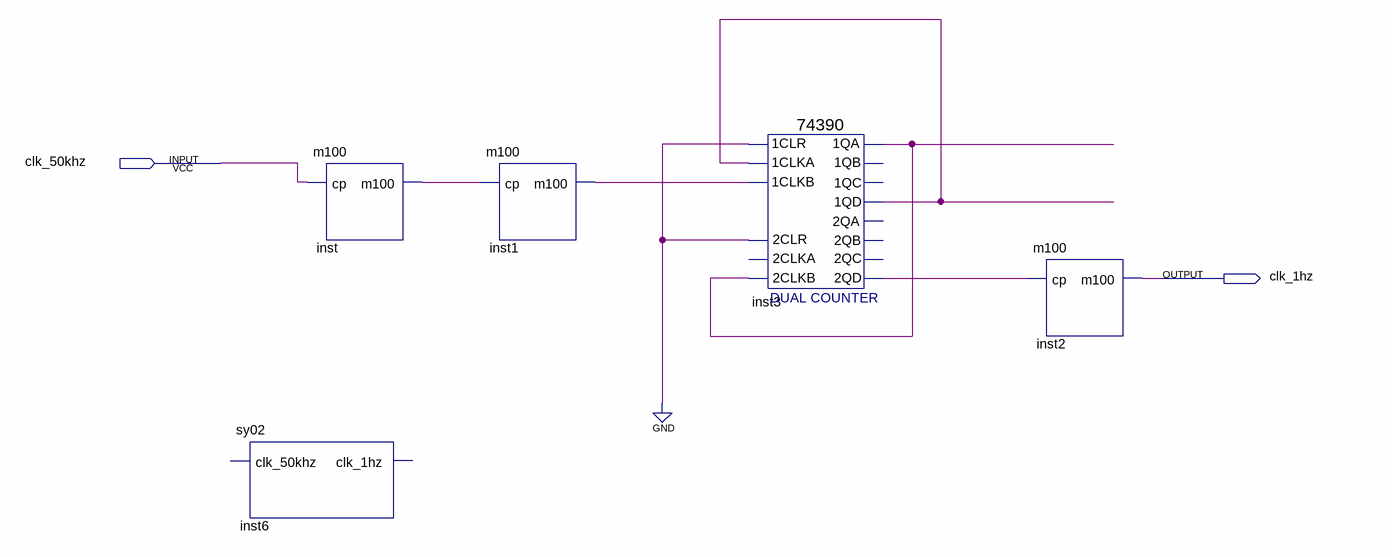
[diagram p0: schematic sheet]
// Quartus schematic sy02.bdf as structural Verilog: 5 symbols, 2 pins
module sy02 (
  input  clk_50khz,
  output clk_1hz
);

  wire inst1_m100, inst3_1qa, inst3_1qd, inst3_2qd, inst_m100;

  sy02 inst6 ();  // open: clk_50khz, clk_1hz
  m100 inst (.cp(clk_50khz), .m100(inst_m100));
  m100 inst1 (.cp(inst_m100), .m100(inst1_m100));
  \74390  inst3 (
    .\2CLR (1'b0), .\2CLKB (inst3_1qa), .\1CLR (1'b0), .\1CLKA (inst3_1qd), .\1CLKB (inst1_m100),
    .\1QA (inst3_1qa), .\1QD (inst3_1qd), .\2QD (inst3_2qd));  // open: 2CLKA, 1QB, 1QC, 2QA, 2QB, 2QC
  m100 inst2 (.cp(inst3_2qd), .m100(clk_1hz));
endmodule
